# EasyEDA Pro project Buck-Boost_1.eprj

# Schematic Schematic1
Create Date: 2024-04-07; Page Name: P1; Project Name: Buck-Boost_1; Schematic Name: Schematic1; Update Date: 2024-04-13; Company: 嘉立创EDA; Page Size: A3; Version: V1.0
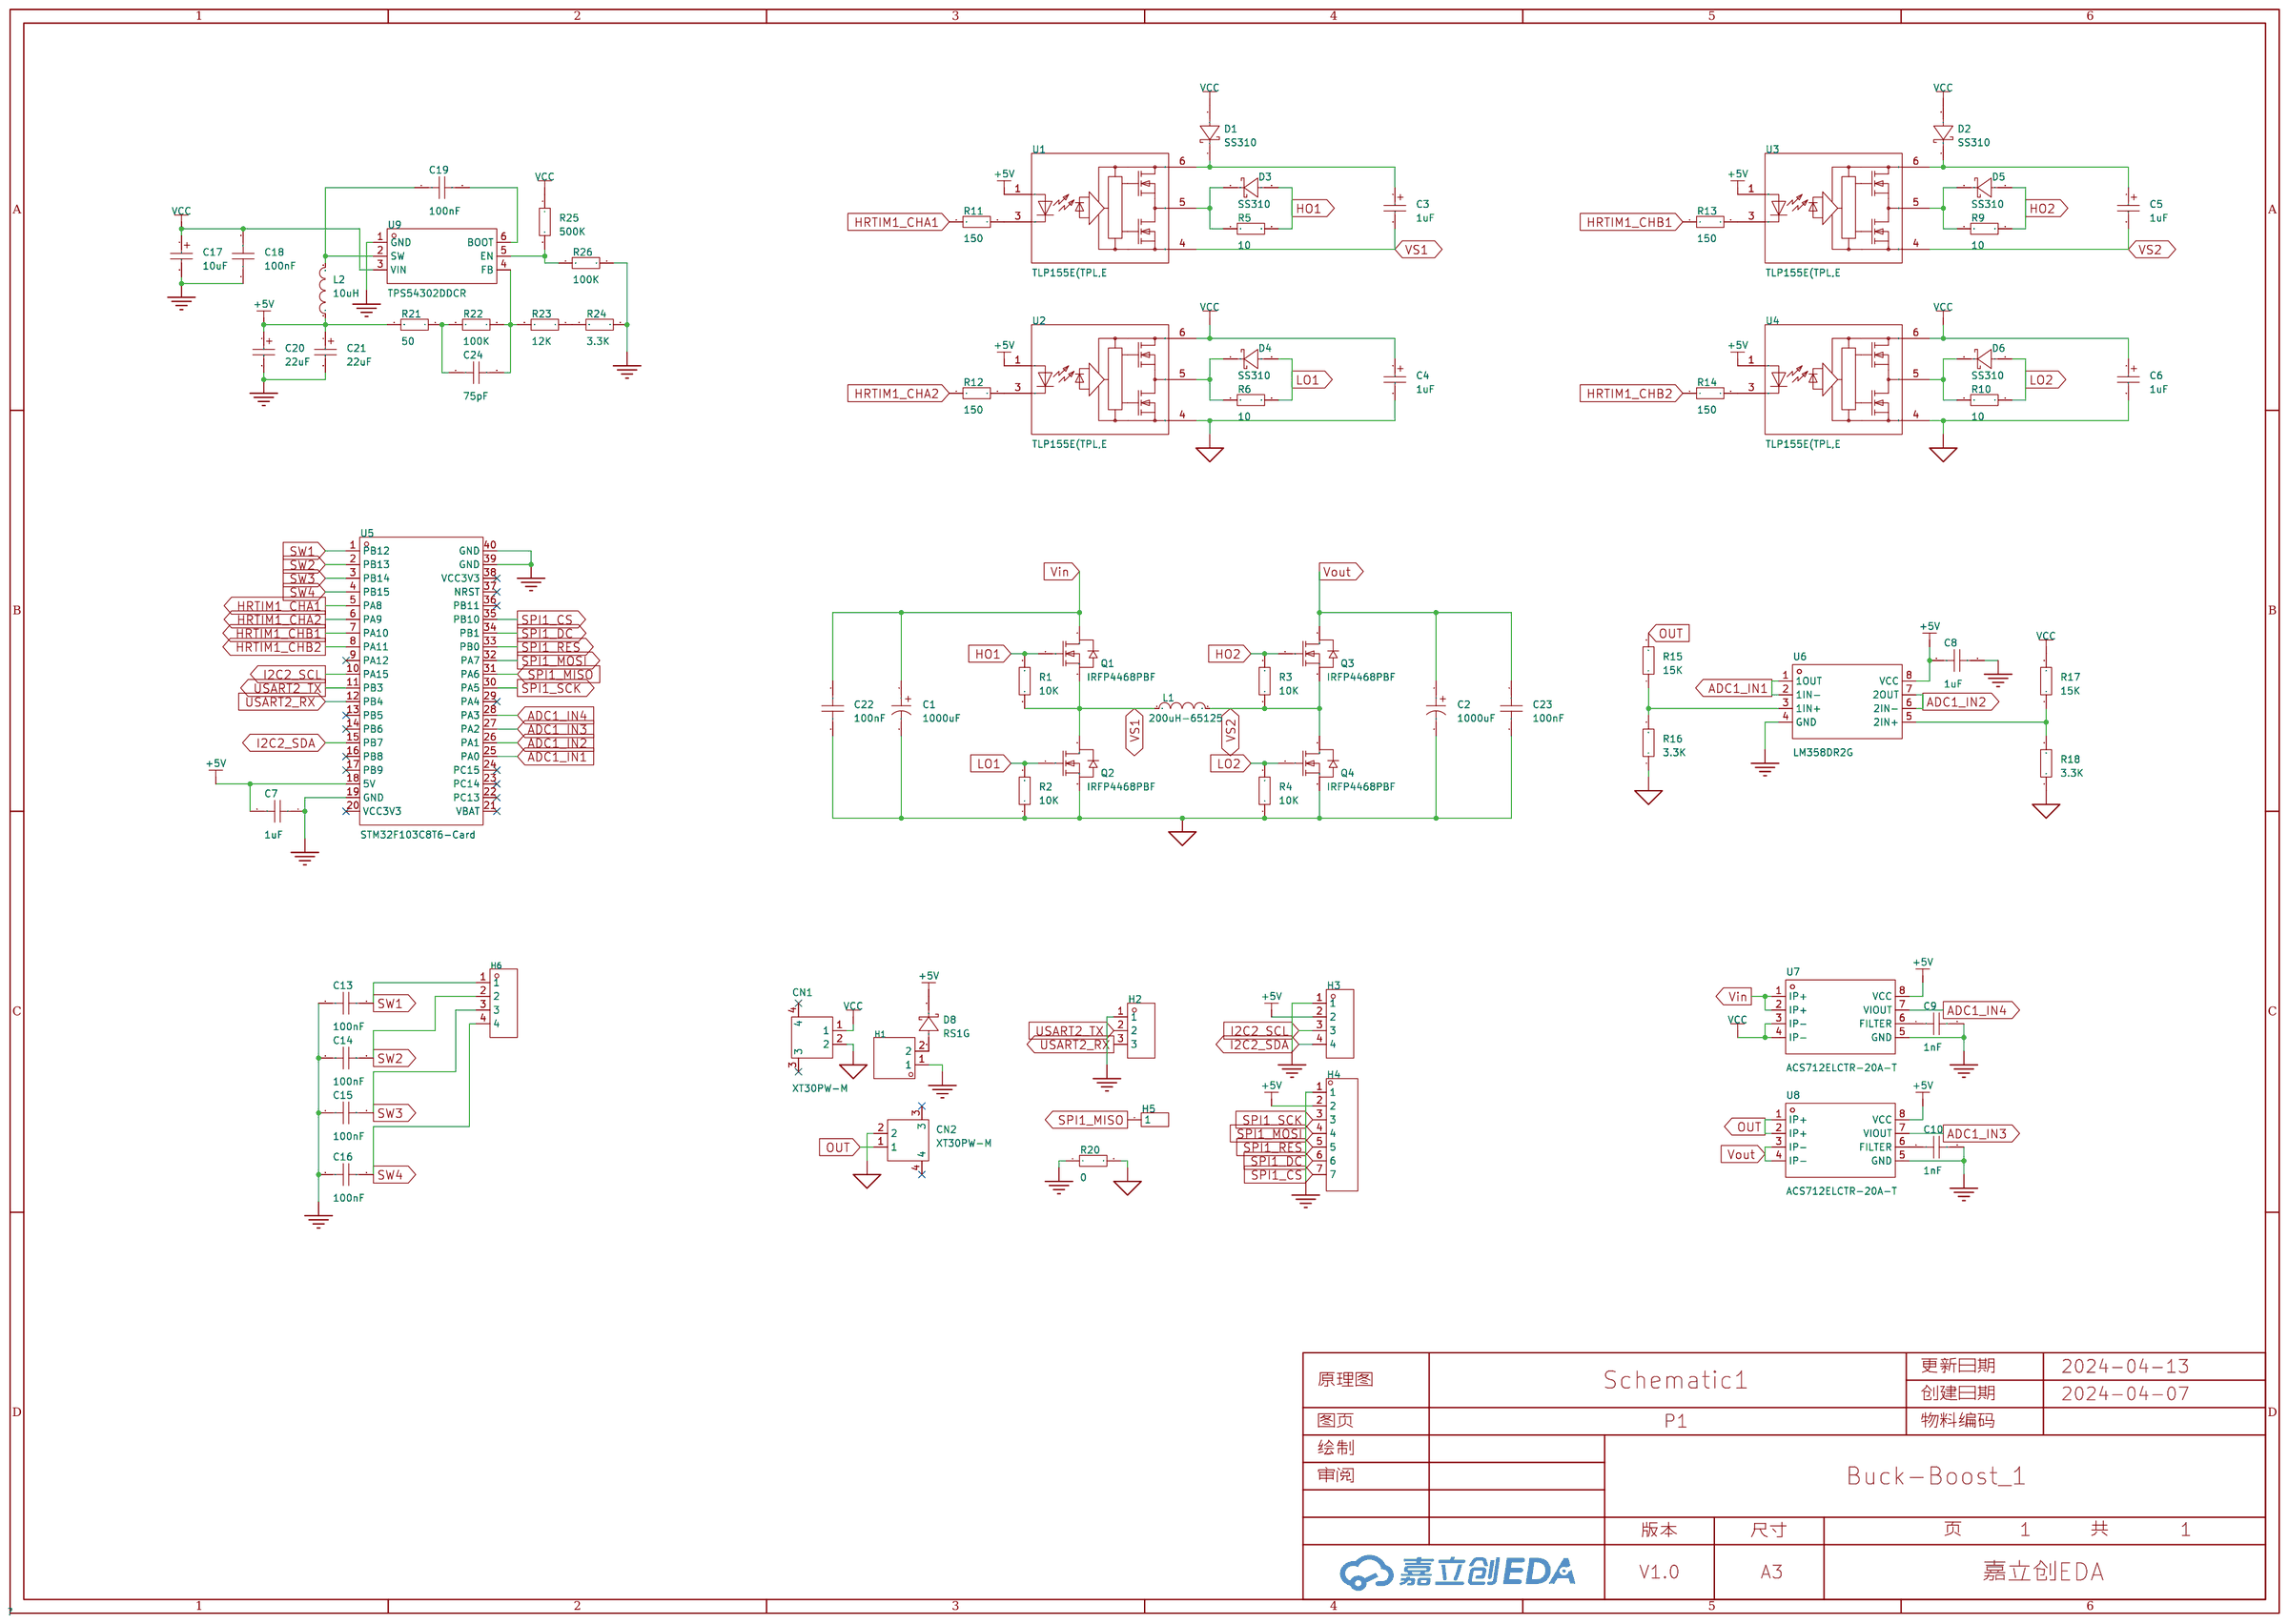
[diagram p0: schematic sheet]

## Parts
C1  1000uF  [CAP-TH_BD13.0-P5.00-D0.6-FD]
C2  1000uF  [CAP-TH_BD13.0-P5.00-D0.6-FD]
C3  1uF  [CASE-A_3216]
C4  1uF  [CASE-A_3216]
C5  1uF  [CASE-A_3216]
C6  1uF  [CASE-A_3216]
C7  1uF  [C0805]
C8  1uF  [C0805]
C9  1nF  [C0805]
C10  1nF  [C0805]
C13  100nF  [C0805]
C14  100nF  [C0805]
C15  100nF  [C0805]
C16  100nF  [C0805]
C17  10uF  [CAP-SMD_L3.5-W2.8-R-RD]
C18  100nF  [C0603]
C19  100nF  [C0603]
C20  22uF  [CASE-B_3528]
C21  22uF  [CASE-B_3528]
C22  100nF  [C0805]
C23  100nF  [C0805]
C24  75pF  [C0603]
CN1  XT30PW-M  [CONN-TH_XT30PW-M]
CN2  XT30PW-M  [CONN-TH_XT30PW-M]
D1  SS310  [SMA_L4.3-W2.6-LS5.2-RD]
D2  SS310  [SMA_L4.3-W2.6-LS5.2-RD]
D3  SS310  [SMA_L4.3-W2.6-LS5.2-RD]
D4  SS310  [SMA_L4.3-W2.6-LS5.2-RD]
D5  SS310  [SMA_L4.3-W2.6-LS5.2-RD]
D6  SS310  [SMA_L4.3-W2.6-LS5.2-RD]
D8  RS1G  [SMA_L4.3-W2.6-LS5.0-RD]
H1  -  [HDR-TH_2P-P2.54-V-M-1]
H2  -  [HDR-TH_3P-P2.54-V-M]
H3  -  [HDR-TH_4P-P2.54-V-F]
H4  -  [HDR-TH_7P-P2.54-V-F]
H5  -  [HDR-TH_1P-V-M_XKB_X4611WV-01I-C28D40]
H6  -  [HDR-TH_4P-P2.54-V-M]
L1  200uH-65125  [IND-TH_200UH-65125]
L2  10uH  [IND-SMD_L4.4-W4.2]
Q1  IRFP4468PBF  [TO-247AC-3_L15.8-W5.0-P5.46-L]
Q2  IRFP4468PBF  [TO-247AC-3_L15.8-W5.0-P5.46-L]
Q3  IRFP4468PBF  [TO-247AC-3_L15.8-W5.0-P5.46-L]
Q4  IRFP4468PBF  [TO-247AC-3_L15.8-W5.0-P5.46-L]
R1  10K  [R0805]
R2  10K  [R0805]
R3  10K  [R0805]
R4  10K  [R0805]
R5  10  [R0805]
R6  10  [R0805]
R9  10  [R0805]
R10  10  [R0805]
R11  150  [R0805]
R12  150  [R0805]
R13  150  [R0805]
R14  150  [R0805]
R15  15K  [R0805]
R16  3.3K  [R0805]
R17  15K  [R0805]
R18  3.3K  [R0805]
R20  0  [R0805]
R21  50  [R0603]
R22  100K  [R0603]
R23  12K  [R0603]
R24  3.3K  [R0603]
R25  500K  [R0603]
R26  100K  [R0603]
U1  TLP155E(TPL,E  [OPTO-SMD-5_L3.7-W4.6-P1.27-LS7.0-BR]
U2  TLP155E(TPL,E  [OPTO-SMD-5_L3.7-W4.6-P1.27-LS7.0-BR]
U3  TLP155E(TPL,E  [OPTO-SMD-5_L3.7-W4.6-P1.27-LS7.0-BR]
U4  TLP155E(TPL,E  [OPTO-SMD-5_L3.7-W4.6-P1.27-LS7.0-BR]
U5  STM32F103C8T6-Card  [CONN-TH_L53.3-W22.9_STM32F103C8T6-CARD]
U6  LM358DR2G  [SOIC-8_L5.0-W4.0-P1.27-LS6.0-BL]
U7  ACS712ELCTR-20A-T  [SOIC-8_L4.9-W3.9-P1.27-LS6.0-BL]
U8  ACS712ELCTR-20A-T  [SOIC-8_L4.9-W3.9-P1.27-LS6.0-BL]
U9  TPS54302DDCR  [SOT-23-6_L2.9-W1.6-P0.95-LS2.8-BL]

## Library data of the parts
C1 C2 = KF102M050I250A: 容值:1000uF;精度:±20%;额定电压:50V;; LCSC Part Name: 1000uF ±20% 50V; Supplier Part: C59328; Manufacturer: CapXon(丰宾); Supplier Footprint: 插件,D13xL25mm; JLCPCB Part Class: Extended Part; Datasheet: https://atta.szlcsc.com/upload/public/pdf/source/20160702/1467448308274.pdf; Supplier: LCSC; Tolerance: ±20%; Rated Voltage: 50V; Lead Spacing: 5mm; φD: 13mm; L: 25mm; Lifetime @ Temp: 5000hrs@105℃
C3-C6 = TAJA105K035RNJ: 容值:1uF;精度:±10%;额定电压:35V;等效串联电阻:7.5Ω@100kHz;; LCSC Part Name: 1uF ±10% 35V; Supplier Part: C7176; Manufacturer: Kyocera AVX; Supplier Footprint: CASE-A-3216; JLCPCB Part Class: Extended Part; Datasheet: https://atta.szlcsc.com/upload/public/pdf/source/20160107/1457707750344.pdf; Supplier: LCSC; Tolerance: ±10%; Rated Voltage: 35V; Equivalent Series Resistance(ESR): 7.5Ω@100kHz; Operating Temperature: -55℃~+125℃
C7-C10 C13-C16 C24 = CAP_0603: Supplier Footprint: 0603
C17 = TAJB106K025RNJ: 容值:10uF;精度:±10%;额定电压:25V;等效串联电阻:2.5Ω@100kHz;; LCSC Part Name: 10uF ±10% 25V; Supplier Part: C7194; Manufacturer: Kyocera AVX; Supplier Footprint: CASE-B-3528; JLCPCB Part Class: 扩展库; Datasheet: https://atta.szlcsc.com/upload/public/pdf/source/20160107/1457707750344.pdf; Supplier: LCSC; Tolerance: ±10%; Rated Voltage: 25V; Equivalent Series Resistance(ESR): 2.5Ω@100kHz; Operating Temperature: -55℃~+125℃
C18 C19 C22 C23 = CAP_0805: Supplier Footprint: 0805
C20 C21 = TAJB226K016RNJ: 容值:22uF;精度:±10%;额定电压:16V;等效串联电阻:2.3Ω@100kHz;; LCSC Part Name: 22uF ±10% 16V; Supplier Part: C8020; Manufacturer: Kyocera AVX; Supplier Footprint: CASE-B-3528; JLCPCB Part Class: Extended Part; Datasheet: https://atta.szlcsc.com/upload/public/pdf/source/20160107/1457707750344.pdf; Supplier: LCSC; Tolerance: ±10%; Rated Voltage: 16V; Equivalent Series Resistance(ESR): 2.3Ω@100kHz; Operating Temperature: -55℃~+125℃
CN1 CN2 = XT30PW-M: 类别:-;类型1:-;; LCSC Part Name: AMASS(艾迈斯)航模插头 卧式弯脚 XT30PW-M公头; Supplier Part: C431092; Manufacturer: AMASS(艾迈斯); JLCPCB Part Class: 扩展库; Datasheet: https://atta.szlcsc.com/upload/public/pdf/source/20220222/6A9F22F7850E25B33E1BE430ADF8560B.pdf; Supplier: LCSC; Brand: 艾迈斯; Type: 航模插头; RatedVoltage: DC 500V; InterfaceType: 公头; RatedCurrent: 15A; RecommendedWireGauge: 16/18/20AWG; contact resistance: 1.2mΩ; specifications: 2pin
D1-D6 = SS310_C15874: 正向压降(Vf):850mV@3A;直流反向耐压(Vr):100V;平均整流电流(Io):3A;; LCSC Part Name: 电压:100V 电流:3A; Supplier Part: C15874; Manufacturer: MDD; Supplier Footprint: SMA(DO-214AC); JLCPCB Part Class: Extended Part; Datasheet: https://atta.szlcsc.com/upload/public/pdf/source/20230314/A80AE34493C69B89E2F4B1712F433538.pdf; Supplier: LCSC; Forward Voltage (Vf@If): 850mV@3A; Reverse Voltage (Vr): 100V; Average Rectified Current (Io): 3A; Reverse Leakage Current (Ir): 500uA@100V; Reverse Leakage Current: 5uA; Reverse Recovery Time (trr): 150ns; Operating Temperature: -55℃~+150℃; Diode Configuration: 独立式
D8 = RS1G_C18199117: 二极管配置:独立式;正向压降(Vf):1.3V@1.0A;直流反向耐压(Vr):400V;平均整流电流(Io):1A;反向恢复时间(trr):150ns;; LCSC Part Name: 电压:400V 电流:1A; Supplier Part: C18199117; Manufacturer: 宏迦橙; Supplier Footprint: SMA(DO-214AC); JLCPCB Part Class: Extended Part; Datasheet: https://atta.szlcsc.com/upload/public/pdf/source/20230925/2DA11C666C5D1E1EAD04936CEF3A63C9.pdf; Supplier: LCSC; Diode Configuration: 独立式; Forward Voltage (Vf@If): 1.3V@1.0A; Reverse Voltage (Vr): 400V; Average Rectified Current (Io): 1A; Reverse Leakage Current: 5uA@400V; Reverse Recovery Time (trr): 150ns; Operating Temperature: -55℃~+150℃; Reverse Leakage Current (Ir): 500uA@100V
H1 = HDR-M_2.54_1x2P: Supplier Part: C124375; Supplier Footprint: 插件
H2 = HDR-M_2.54_1x3P: Supplier Part: C2937625; Supplier Footprint: 插件
H3 = HDR-F_2.54_1x4P: Supplier Part: C2718488; Supplier Footprint: 插件
H4 = HDR-F_2.54_1x7P: Supplier Part: C124418; Supplier Footprint: 插件
H5 = HDR-M_2.54_1x1P: Supplier Part: C81276; Supplier Footprint: 插件; JLCPCB Part Class: Extended Part
H6 = HDR-M_2.54_1x4P: Supplier Part: C492403; Supplier Footprint: 插件
L1 = 200uH-65125: Supplier Part: C9900012734; Supplier Footprint: IND-TH; JLCPCB Part Class: Extended Part; Supplier: LCSC
L2 = FXL0420-100-M: 电感值:10uH;精度:±20%;额定电流:1.6A;饱和电流(Isat):2.2A;类型:一体成型电感;; LCSC Part Name: 10uH ±20% 2.2A; Supplier Part: C177242; Manufacturer: cjiang(长江微电); Supplier Footprint: SMD,4.2x4.4mm; JLCPCB Part Class: Extended Part; Datasheet: https://atta.szlcsc.com/upload/public/pdf/source/20200117/C485363_A2440626DC7482D75DD0DD56D1883FBF.pdf; Supplier: LCSC; Tolerance: ±20%; Rated Current: 1.6A; Saturation Current (Isat): 2.2A; DC Resistance (DCR): 282mΩ; Type: 一体成型电感
Q1-Q4 = IRFP4468PBF: 类型:N沟道;漏源电压(Vdss):100V;连续漏极电流(Id):195A;功率(Pd):520W;导通电阻(RDS(on)@Vgs,Id):2.6mΩ@10V,180A;阈值电压(Vgs(th)@Id):4V@250uA;; LCSC Part Name: N沟道 耐压:100V 电流:195A; Supplier Part: C2919; Manufacturer: Infineon(英飞凌); Supplier Footprint: TO-247AC-3; JLCPCB Part Class: 扩展库; Datasheet: https://atta.szlcsc.com/upload/public/pdf/source/20200421/C513172_0206954A6A294F6A4994DAF9F319B5AC.pdf; Supplier: LCSC; Type: N沟道; Drain Source Voltage (Vdss): 100V; Continuous Drain Current (Id): 195A; Power Dissipation (Pd): 520W; Drain Source On Resistance (RDS(on)@Vgs,Id): 2.6mΩ@10V,180A; Gate Threshold Voltage (Vgs(th)@Id): 4V@250uA; Total Gate Charge (Qg@Vgs): 540nC@10V; Input Capacitance (Ciss@Vds): 19.86nF@50V; Operating Temperature: -55℃~+175℃@(Tj)
R1-R6 R9-R18 R20 = Res_0603: Supplier Footprint: 0603
R21-R26 = Res_0805: Supplier Footprint: 0805
U1-U4 = TLP155E(TPL,E: 输入类型:DC;电源电压:10V~30V;共模瞬变抗扰度CMTI:15kV/us;传播延迟tpLH/tpHL:170ns；170ns;; Supplier Part: C56499; Manufacturer: TOSHIBA(东芝); Supplier Footprint: SOIC-5-4.6mm; JLCPCB Part Class: 扩展库; Datasheet: https://atta.szlcsc.com/upload/public/pdf/source/20150821/1457707350132.pdf; Supplier: LCSC; Input Type: DC; Supply Voltage: 10V~30V; Common Mode Transient Immunity (CMTI): 15kV/us; Propagation Delay tpLH/tpHL: 170ns；170ns; Number of Channels: 1; Operating Temperature: -40℃~+100℃
U5 = STM32F103C8T6-Card: Supplier Part: C9900077949; Supplier Footprint: 插件; Supplier: LCSC
U6 = LM358DR2G: 放大器数:双路;增益带宽积(GBP):1MHz;输入偏置电流(Ib):45nA;压摆率(SR):-;带宽(-3db):-;; LCSC Part Name: LM358DR2G 运算放大器，单电源，双路; Supplier Part: C7950; Manufacturer: onsemi(安森美); Supplier Footprint: SOIC-8; JLCPCB Part Class: 基础库; Datasheet: https://atta.szlcsc.com/upload/public/pdf/source/20150124/1457707258826.pdf; Supplier: LCSC; Number of Circuits: 双路; Gain Bandwidth Product(GBP): 1MHz; Current - Input Bias(Ib): 45nA; Output Current: 40mA; Supply Current: 1.5mA; Operating Temperature: 0℃~+70℃
U7 U8 = ACS712ELCTR-20A-T: 电流测量范围:20A;灵敏度:100mV/A;; Supplier Part: C10681; Manufacturer: ALLEGRO(美国埃戈罗); Supplier Footprint: SOIC-8; JLCPCB Part Class: 扩展库; Datasheet: https://atta.szlcsc.com/upload/public/pdf/source/20130706/1457706622210.pdf; Supplier: LCSC; Current Range: 20A; Supply Voltage: 5V; Sensitivity: 100mV/A; Operating Temperature: -40℃~+85℃
U9 = TPS54302DDCR: 功能类型:降压型;输出类型:可调;输入电压:4.5V~28V;输出电压:596mV~28V;输出电流(最大值):3A;; Supplier Part: C311983; Manufacturer: TI(德州仪器); Supplier Footprint: TSOT-23-6; JLCPCB Part Class: 扩展库; Datasheet: https://www.ti.com/cn/lit/gpn/tps54302; Supplier: LCSC; Function: 降压型; Output Type: 可调; Input Voltage: 4.5V~28V; Output Voltage: 596mV~28V; Output Current (Max): 3A; Switching Frequency: 400kHz; Operating Temperature: -40℃~+125℃@(TJ); Synchronous Rectification: 是; Number of Outputs: 1; Topology: 降压式; Switch tube (built-in/external): 内置

## Nets
+5V: C7.2 C8.1 C20.1 C21.1 D8.1(K) H3.2 H4.2 L2.1 R21.2 U1.1(AN) U2.1(AN) U3.1(AN) U4.1(AN) U5.18(5V) U6.8(VCC) U7.8(VCC) U8.8(VCC)
AGND: C1.2 C2.2 C4.2 C6.2 C22.2 C23.2 CN1.2 CN2.2 Q2.3(S) Q4.3(S) R2.1 R4.1 R16.1 R18.1 R20.2 U2.4(GND) U4.4(GND)
GND: C7.1 C8.2 C9.2 C10.2 C13.1 C14.1 C15.1 C16.1 C17.2 C18.1 C20.2 C21.2 H1.1 H2.1 H3.1 H4.1 R20.1 R24.2 R26.2 U5.19(GND) U5.39(GND) U5.40(GND) U6.4(GND) U7.5(GND) U8.5(GND) U9.1(GND)
VCC: C4.1 C6.1 C17.1 C18.2 CN1.1 D1.2(A) D2.2(A) R17.2 R25.1 U2.6(VCC) U4.6(VCC) U7.3(IP-) U7.4(IP-) U9.3(VIN)
Vin: C1.1 C22.1 Q1.2(D) U7.1(IP+) U7.2(IP+)
ADC1_IN1: U5.25(PA0) U6.1(1OUT) U6.2(1IN-)
ADC1_IN2: U5.26(PA1) U6.6(2IN-) U6.7(2OUT)
ADC1_IN3: U5.27(PA2) U8.7(VIOUT)
ADC1_IN4: U5.28(PA3) U7.7(VIOUT)
HO1: D3.2(A) Q1.1(G) R1.2 R5.2
HO2: D5.2(A) Q3.1(G) R3.2 R9.2
HRTIM1_CHA1: R11.1 U5.5(PA8)
HRTIM1_CHA2: R12.1 U5.6(PA9)
HRTIM1_CHB1: R13.1 U5.7(PA10)
HRTIM1_CHB2: R14.1 U5.8(PA11)
I2C2_SCL: H3.3 U5.10(PA15)
I2C2_SDA: H3.4 U5.15(PB7)
LO1: D4.2(A) Q2.1(G) R2.2 R6.2
LO2: D6.2(A) Q4.1(G) R4.2 R10.2
OUT: CN2.1 R15.2 U8.1(IP+) U8.2(IP+)
SPI1_CS: H4.7 U5.35(PB10)
SPI1_DC: H4.6 U5.34(PB1)
SPI1_MISO: H5.1 U5.31(PA6)
SPI1_MOSI: H4.4 U5.32(PA7)
SPI1_RES: H4.5 U5.33(PB0)
SPI1_SCK: H4.3 U5.30(PA5)
SW1: C13.2 H6.1 U5.1(PB12)
SW2: C14.2 H6.2 U5.2(PB13)
SW3: C15.2 H6.3 U5.3(PB14)
SW4: C16.2 H6.4 U5.4(PB15)
USART2_RX: H2.3 U5.12(PB4)
USART2_TX: H2.2 U5.11(PB3)
Vout: C2.1 C23.1 Q3.2(D) U8.3(IP-) U8.4(IP-)
VS1: C3.2 L1.1 Q1.3(S) Q2.2(D) R1.1 U1.4(GND)
VS2: C5.2 L1.2 Q3.3(S) Q4.2(D) R3.1 U3.4(GND)
$1N1235: D4.1(K) R6.1 U2.5(VO)
$1N1253: D3.1(K) R5.1 U1.5(VO)
$1N1489: C3.1 D1.1(K) U1.6(VCC)
$1N2345: R15.1 R16.2 U6.3(1IN+)
$1N3865: R11.2 U1.3(CAT)
$1N3891: R12.2 U2.3(CAT)
$1N4391: C9.1 U7.6(FILTER)
$1N4589: R17.1 R18.2 U6.5(2IN+)
$1N15576: D6.1(K) R10.1 U4.5(VO)
$1N15577: D5.1(K) R9.1 U3.5(VO)
$1N15585: R13.2 U3.3(CAT)
$1N15586: R14.2 U4.3(CAT)
$1N15724: C10.1 U8.6(FILTER)
$1N19181: D8.2(A) H1.2
$1N21866: C5.1 D2.1(K) U3.6(VCC)
$1N29389: R23.1 R24.1
$1N29611: C19.2 U9.6(BOOT)
$1N29695: R25.2 R26.1 U9.5(EN)
$1N29983: C19.1 L2.2 U9.2(SW)
$1N32235: C24.1 R21.1 R22.2
$1N32239: C24.2 R22.1 R23.2 U9.4(FB)

Not connected (* = marked no-connect by the designer): CN1 3* 4*; CN2 3* 4*; U5 9(PA12)* 13(PB5)* 14(PB6)* 16(PB8)* 17(PB9)* 20(VCC3V3)* 21(VBAT)* 22(PC13)* 23(PC14)* 24(PC15)* 29(PA4)* 36(PB11)* 37(NRST)* 38(VCC3V3)*

# Board PCB1
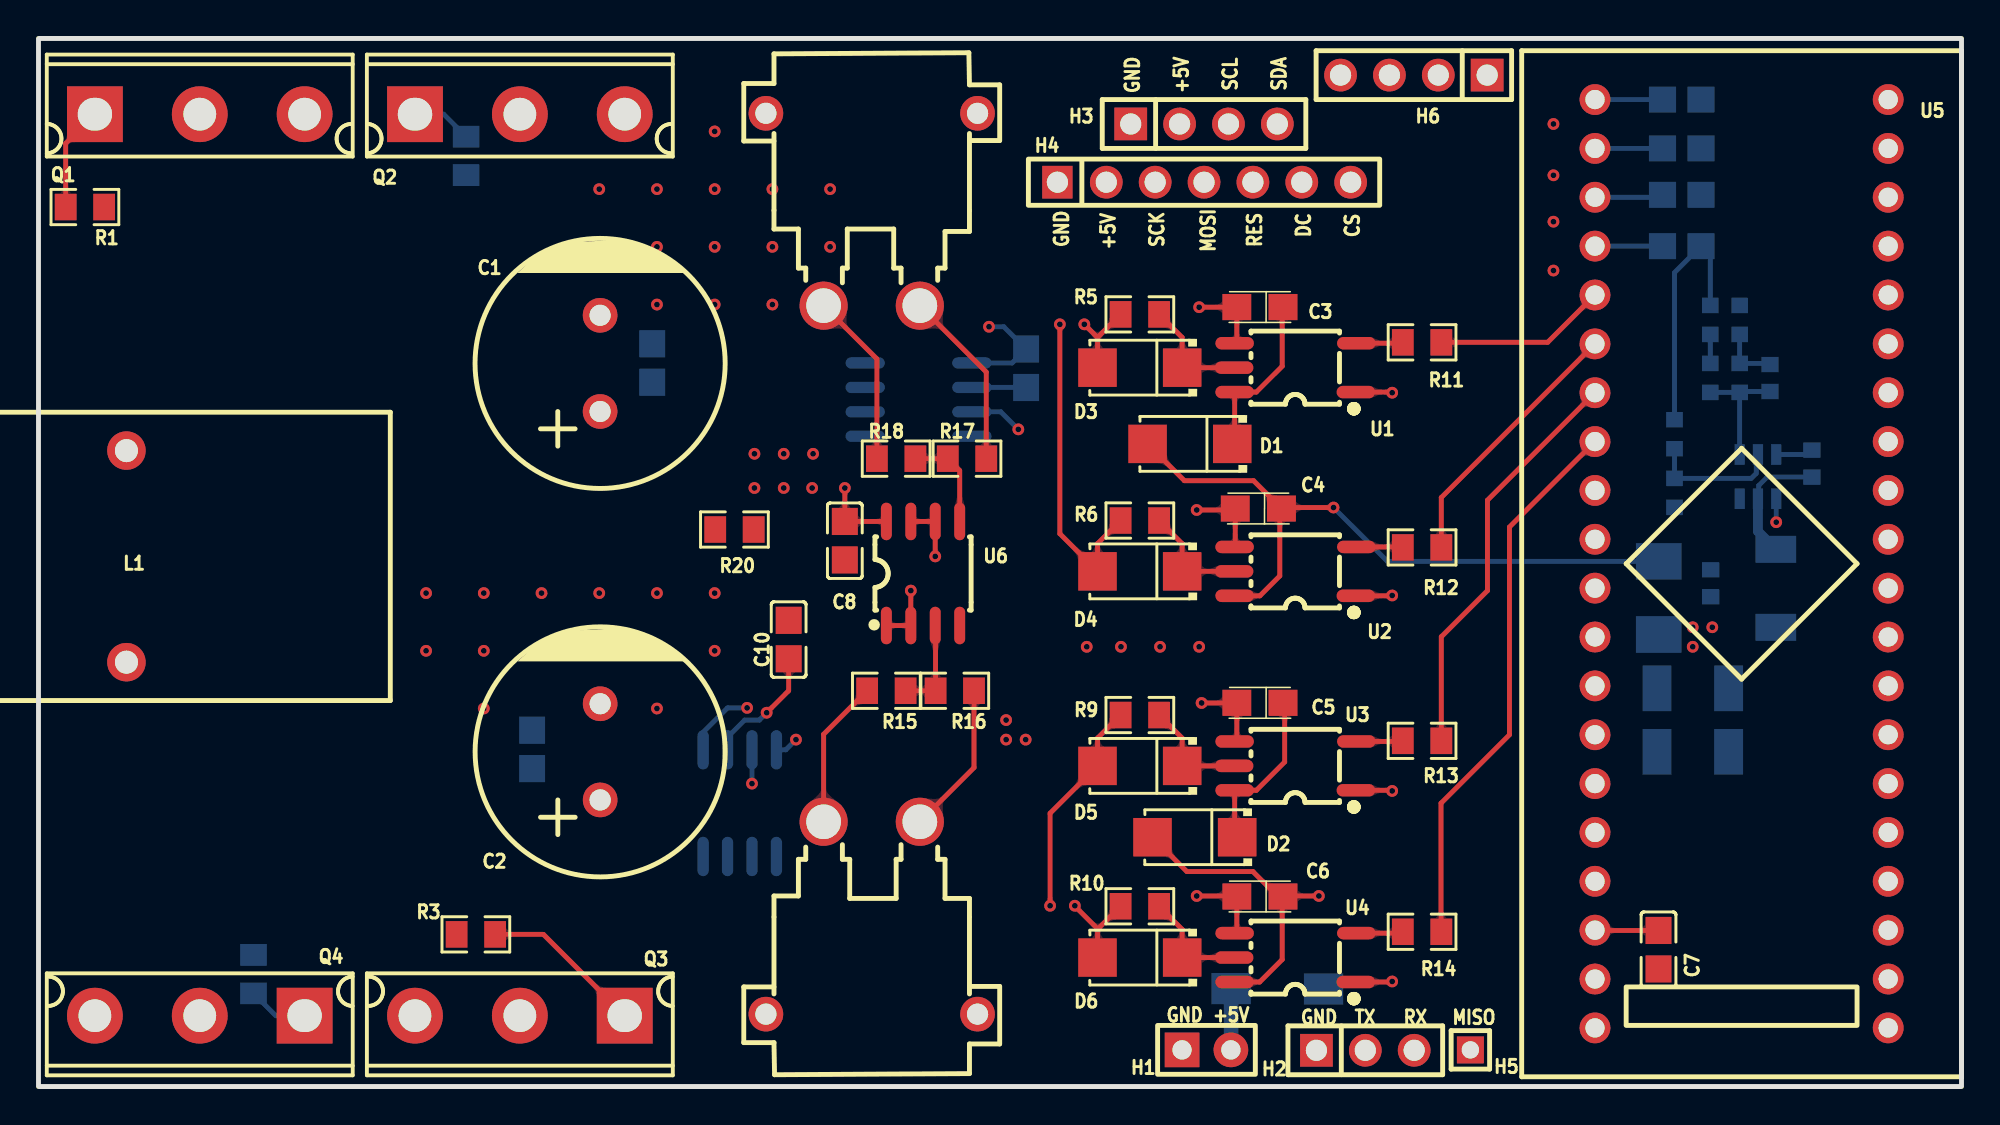
[diagram p1: board, top side]
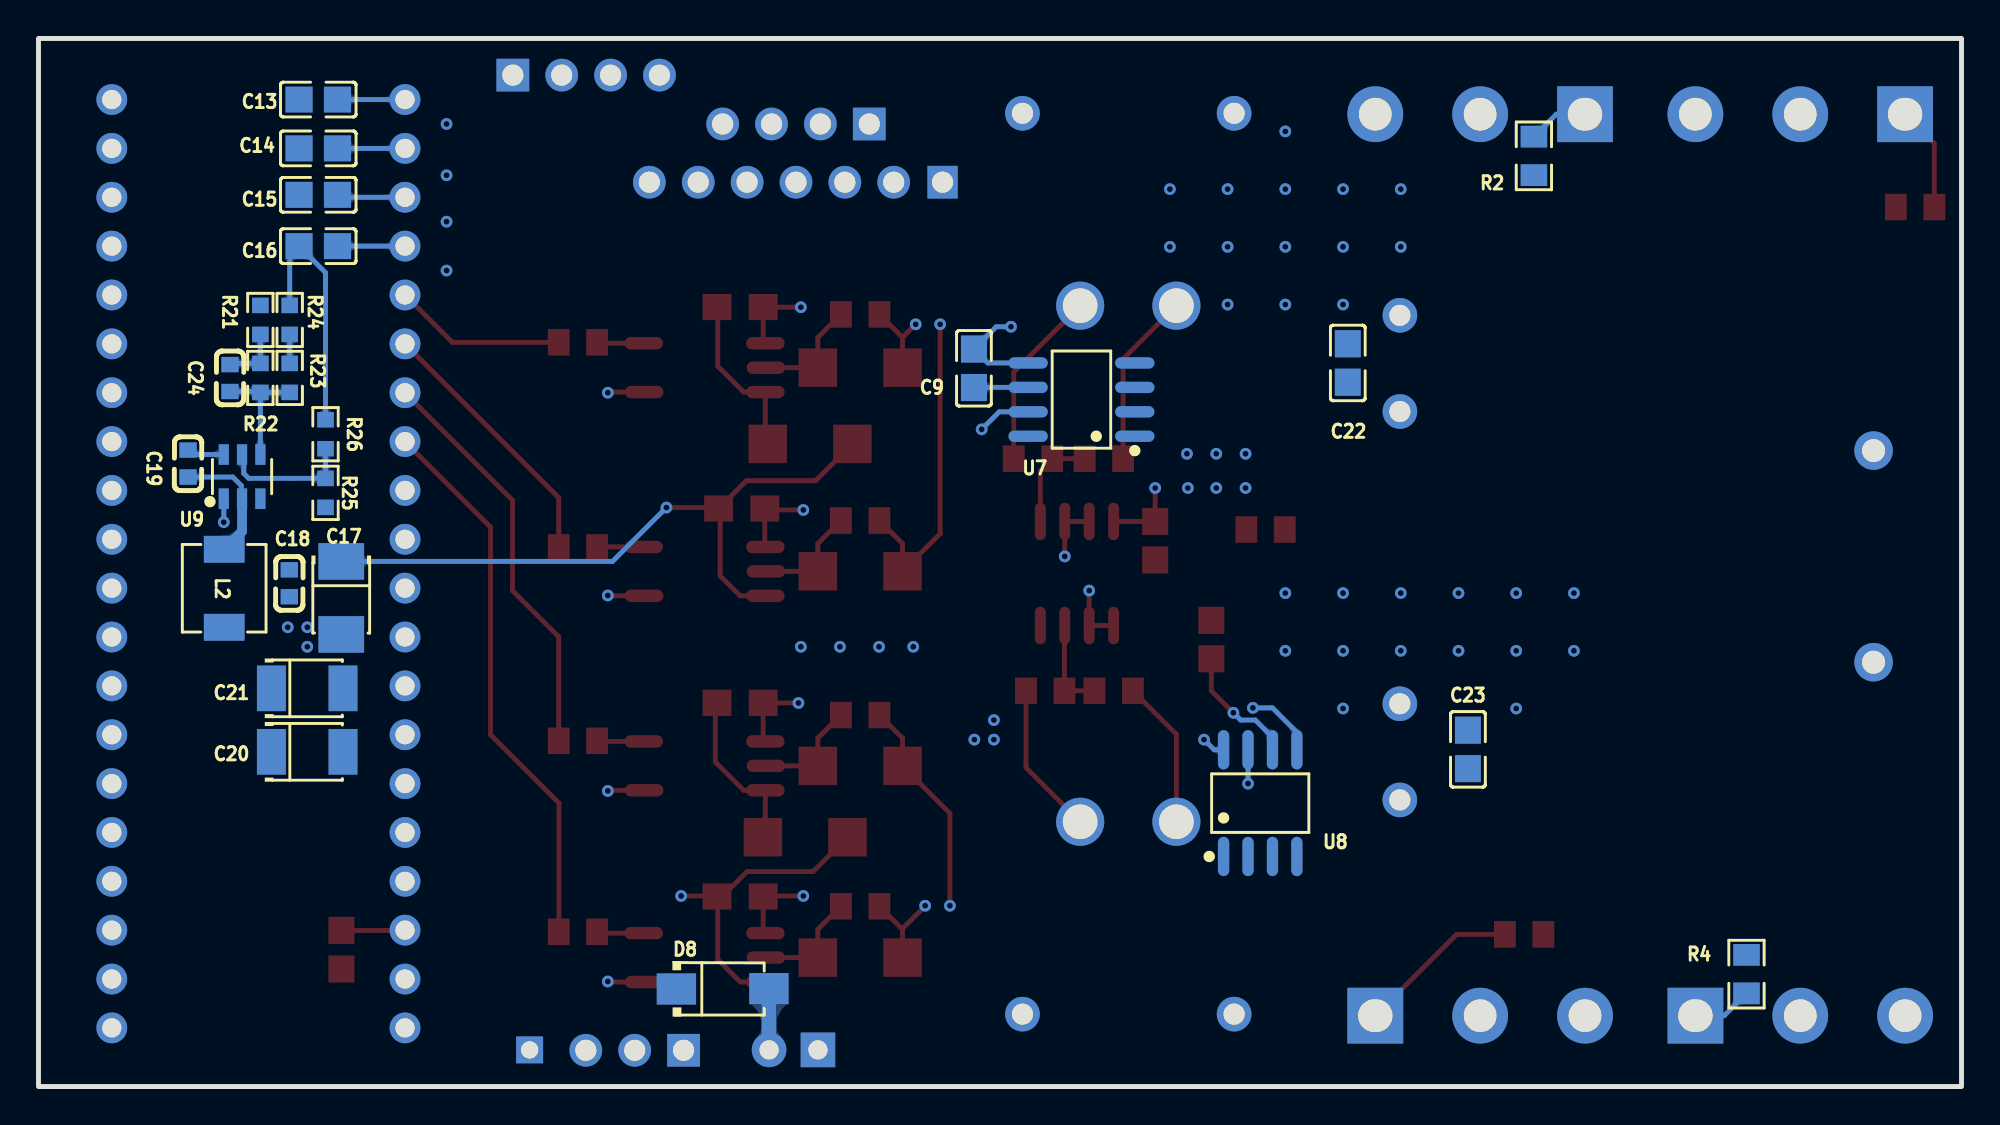
[diagram p2: board, bottom side, seen from below]

Outline 99.95 x 54.48 mm; copper layers: Top Layer, Inner1, Inner2, Bottom Layer. Coordinates in mm from the lower left corner of the outline.
Outline path: rectangle 0,54.48 99.95,0
Stack: Top Layer 0.035mm 外层铜厚1oz / Dielectric1 0.2104mm 7628 RC49% 8.6mil / Inner1 0.0152mm 内层铜厚 / Dielectric2 1.065mm 1.1mm H/HOZ 含铜 / Inner2 0.0152mm 内层铜厚 / Dielectric3 0.2104mm 7628 RC49% 8.6mil / Bottom Layer 0.035mm 外层铜厚1oz

## Design rules (mm)
template: 自定义配置
spacing copperThickness1oz (default): track to track 0.102, other pairs 0.152 to 0.3
spacing copperThickness2oz: track to track 0.203, other pairs 0.152 to 0.3
track width copperThickness1oz (default): min 0.127, default 0.254, max 2.54
track width copperThickness2oz: min 0.203, default 0.254, max 2.54
differential pair differentialPair (default): width min 0.127, default 0.254, max 2.54; gap min 0.152, default 0.152
via viaSize (default): diameter min 0.5, default 0.61, max 10; hole min 0.3, default 0.305, max 6.3

## Placement (name value [footprint] x y rotation side)
C1  1000uF  [CAP-TH_BD13.0-P5.00-D0.6-FD]  29.19 37.59 90 top
C2  1000uF  [CAP-TH_BD13.0-P5.00-D0.6-FD]  29.19 17.4 90 top
C3  1uF  [CASE-A_3216]  63.48 40.52 180 top
C4  1uF  [CASE-A_3216]  63.4 30.05 180 top
C5  1uF  [CASE-A_3216]  63.48 19.95 180 top
C6  1uF  [CASE-A_3216]  63.48 9.88 180 top
C7  1uF  [C0805]  84.2 7.11 90 top
C8  1uF  [C0805]  41.91 28.38 270 top
C9  1nF  [C0805]  51.33 37.34 90 bottom
C10  1nF  [C0805]  38.99 23.24 90 top
C13  100nF  [C0805]  85.41 51.31 180 bottom
C14  100nF  [C0805]  85.41 48.77 180 bottom
C15  100nF  [C0805]  85.41 46.36 180 bottom
C16  100nF  [C0805]  85.41 43.69 180 bottom
C17  10uF  [CAP-SMD_L3.5-W2.8-R-RD]  84.21 25.4 90 bottom
C18  100nF  [C0603]  86.91 26.16 90 bottom
C19  100nF  [C0603]  92.17 32.39 90 bottom
C20  22uF  [CASE-B_3528]  85.98 17.4 180 bottom
C21  22uF  [CASE-B_3528]  85.98 20.7 180 bottom
C22  100nF  [C0805]  31.9 37.61 90 bottom
C23  100nF  [C0805]  25.65 17.53 90 bottom
C24  75pF  [C0603]  90 36.83 270 bottom
CN1  XT30PW-M  [CONN-TH_XT30PW-M]  43.31 45.59 180 top
CN2  XT30PW-M  [CONN-TH_XT30PW-M]  43.31 8.76 0 top
D1  SS310  [SMA_L4.3-W2.6-LS5.2-RD]  59.85 33.41 180 top
D2  SS310  [SMA_L4.3-W2.6-LS5.2-RD]  60.1 12.96 180 top
D3  SS310  [SMA_L4.3-W2.6-LS5.2-RD]  57.24 37.37 180 top
D4  SS310  [SMA_L4.3-W2.6-LS5.2-RD]  57.24 26.78 180 top
D5  SS310  [SMA_L4.3-W2.6-LS5.2-RD]  57.24 16.67 180 top
D6  SS310  [SMA_L4.3-W2.6-LS5.2-RD]  57.24 6.7 180 top
D8  RS1G  [SMA_L4.3-W2.6-LS5.0-RD]  64.39 5.08 180 bottom
H1  -  [HDR-TH_2P-P2.54-V-M-1]  60.71 1.91 0 top
H2  -  [HDR-TH_3P-P2.54-V-M]  68.96 1.88 0 top
H3  -  [HDR-TH_4P-P2.54-V-F]  60.58 50.04 0 top
H4  -  [HDR-TH_7P-P2.54-V-F]  60.58 47.01 0 top
H5  -  [HDR-TH_1P-V-M_XKB_X4611WV-01I-C28D40]  74.42 1.91 0 top
H6  -  [HDR-TH_4P-P2.54-V-M]  71.48 52.58 180 top
L1  200uH-65125  [IND-TH_200UH-65125]  4.57 27.56 180 top
L2  10uH  [IND-SMD_L4.4-W4.2]  90.3 25.9 270 bottom
Q1  IRFP4468PBF  [TO-247AC-3_L15.8-W5.0-P5.46-L]  8.38 50.55 0 top
Q2  IRFP4468PBF  [TO-247AC-3_L15.8-W5.0-P5.46-L]  25.02 50.55 0 top
Q3  IRFP4468PBF  [TO-247AC-3_L15.8-W5.0-P5.46-L]  25.02 3.68 180 top
Q4  IRFP4468PBF  [TO-247AC-3_L15.8-W5.0-P5.46-L]  8.38 3.68 180 top
R1  10K  [R0805]  2.41 45.72 180 top
R2  10K  [R0805]  22.22 48.38 90 bottom
R3  10K  [R0805]  22.73 7.91 0 top
R4  10K  [R0805]  11.18 5.84 270 bottom
R5  10  [R0805]  57.24 40.14 180 top
R6  10  [R0805]  57.24 29.42 180 top
R9  10  [R0805]  57.24 19.31 180 top
R10  10  [R0805]  57.24 9.37 180 top
R11  150  [R0805]  71.91 38.69 180 top
R12  150  [R0805]  71.91 28.03 180 top
R13  150  [R0805]  71.91 17.97 180 top
R14  150  [R0805]  71.91 8.05 180 top
R15  15K  [R0805]  44.07 20.57 180 top
R16  3.3K  [R0805]  47.62 20.57 180 top
R17  15K  [R0805]  48.26 32.64 0 top
R18  3.3K  [R0805]  44.58 32.64 0 top
R20  0  [R0805]  36.17 28.96 180 top
R21  50  [R0603]  88.42 39.85 90 bottom
R22  100K  [R0603]  88.42 36.84 90 bottom
R23  12K  [R0603]  86.89 36.84 270 bottom
R24  3.3K  [R0603]  86.89 39.85 90 bottom
R25  500K  [R0603]  85.03 30.86 90 bottom
R26  100K  [R0603]  85.03 33.91 90 bottom
U1  TLP155E(TPL,E  [OPTO-SMD-5_L3.7-W4.6-P1.27-LS7.0-BR]  65.32 37.37 0 top
U2  TLP155E(TPL,E  [OPTO-SMD-5_L3.7-W4.6-P1.27-LS7.0-BR]  65.32 26.78 0 top
U3  TLP155E(TPL,E  [OPTO-SMD-5_L3.7-W4.6-P1.27-LS7.0-BR]  65.32 16.67 0 top
U4  TLP155E(TPL,E  [OPTO-SMD-5_L3.7-W4.6-P1.27-LS7.0-BR]  65.32 6.7 0 top
U5  STM32F103C8T6-Card  [CONN-TH_L53.3-W22.9_STM32F103C8T6-CARD]  88.52 27.18 270 top
U6  LM358DR2G  [SOIC-8_L5.0-W4.0-P1.27-LS6.0-BL]  45.97 26.67 0 top
U7  ACS712ELCTR-20A-T  [SOIC-8_L4.9-W3.9-P1.27-LS6.0-BL]  45.74 35.71 90 bottom
U8  ACS712ELCTR-20A-T  [SOIC-8_L4.9-W3.9-P1.27-LS6.0-BL]  36.45 14.73 180 bottom
U9  TPS54302DDCR  [SOT-23-6_L2.9-W1.6-P0.95-LS2.8-BL]  89.37 31.71 180 bottom

## Footprints (pads in the part's own frame, mm; a bottom-side part is the same pattern mirrored in y, then rotated)
C0603
  rect 0.8x0.9 smd: 1(-0.7,0) 2(0.7,0)
C0805
  rect 1.41x1.35 smd: 1(-1,0) 2(1,0)
CAP-SMD_L3.5-W2.8-R-RD
  rect 1.9x2.376 smd: 1(1.899,0) 2(-1.899,0)
CAP-TH_BD13.0-P5.00-D0.6-FD
  round 1.8 hole 1.1: 1(-2.5,0) 2(2.5,0)
CASE-A_3216
  rect 1.5x1.359 smd: 1(-1.2,0) 2(1.2,0)
CASE-B_3528
  rect 1.506x2.376 smd: 1(-1.861,0) 2(1.861,0)
CONN-TH_L53.3-W22.9_STM32F103C8T6-CARD
  round 1.6 hole 1: 1(-24.13,-7.62) 2(-21.59,-7.62) 3(-19.05,-7.62) 4(-16.51,-7.62) 5(-13.97,-7.62) 6(-11.43,-7.62) 7(-8.89,-7.62) 8(-6.35,-7.62) 9(-3.81,-7.62) 10(-1.27,-7.62) 11(1.27,-7.62) 12(3.81,-7.62) 13(6.35,-7.62) 14(8.89,-7.62) 15(11.43,-7.62) 16(13.97,-7.62) 17(16.51,-7.62) 18(19.05,-7.62) 19(21.59,-7.62) 20(24.13,-7.62) 21(24.13,7.62) 22(21.59,7.62) 23(19.05,7.62) 24(16.51,7.62) 25(13.97,7.62) 26(11.43,7.62) 27(8.89,7.62) 28(6.35,7.62) 29(3.81,7.62) 30(1.27,7.62) 31(-1.27,7.62) 32(-3.81,7.62) 33(-6.35,7.62) 34(-8.89,7.62) 35(-11.43,7.62) 36(-13.97,7.62) 37(-16.51,7.62) 38(-19.05,7.62) 39(-21.59,7.62) 40(-24.13,7.62)
CONN-TH_XT30PW-M
  round 2.5 hole 1.8: 1(-2.5,5) 2(2.5,5)
  round 1.8 hole 1.1: 3(5.5,-5) 4(-5.5,-5)
HDR-TH_1P-V-M_XKB_X4611WV-01I-C28D40
  rect 1.4x1.4 hole 0.9: 1(0,0)
HDR-TH_2P-P2.54-V-M-1
  rect 1.8x1.8 hole 1: 1(-1.27,0)
  round 1.8 hole 1: 2(1.27,0)
HDR-TH_3P-P2.54-V-M
  rect 1.7x1.7 hole 1.1: 1(-2.54,0)
  round 1.7 hole 1.1: 2(0,0) 3(2.54,0)
HDR-TH_4P-P2.54-V-F
  rect 1.7x1.7 hole 1.1: 1(-3.81,0)
  round 1.7 hole 1.1: 2(-1.27,0) 3(1.27,0) 4(3.81,0)
HDR-TH_4P-P2.54-V-M
  rect 1.7x1.7 hole 1.1: 1(-3.81,0)
  round 1.7 hole 1.1: 2(-1.27,0) 3(1.27,0) 4(3.81,0)
HDR-TH_7P-P2.54-V-F
  rect 1.575x1.7 hole 1.1: 1(-7.62,0)
  round 1.7 hole 1.1: 2(-5.08,0) 3(-2.54,0) 4(0,0) 5(2.54,0) 6(5.08,0) 7(7.62,0)
IND-SMD_L4.4-W4.2
  rect 1.4x2.12 smd: 1(2.028,0) 2(-2.028,0)
IND-TH_200UH-65125
  round 2 hole 1.2: 1(0,-5.5) 2(0,5.5)
OPTO-SMD-5_L3.7-W4.6-P1.27-LS7.0-BR
  oval 2x0.65 smd: 1(3.15,-1.27) 3(3.175,1.27) 4(-3.15,1.27) 5(-3.175,0) 6(-3.15,-1.27)
R0603
  rect 0.806x0.864 smd: 1(-0.753,0) 2(0.753,0)
R0805
  rect 1.133x1.377 smd: 1(-1,0) 2(1,0)
SMA_L4.3-W2.6-LS5.0-RD
  rect 2.046x1.62 smd: 1(-2.404,-0.009) 2(2.404,0.009)
SMA_L4.3-W2.6-LS5.2-RD
  rect 2x2 smd: 1(-2.2,0) 2(2.2,0)
SOIC-8_L4.9-W3.9-P1.27-LS6.0-BL
  oval 0.588x2.045 smd: 1(-1.905,-2.772) 2(-0.635,-2.772) 3(0.635,-2.772) 4(1.905,-2.772) 5(1.905,2.772) 6(0.635,2.772) 7(-0.635,2.772) 8(-1.905,2.772)
SOIC-8_L5.0-W4.0-P1.27-LS6.0-BL
  oval 0.569x1.95 smd: 1(-1.905,-2.705) 2(-0.635,-2.705) 3(0.635,-2.705) 4(1.905,-2.705) 5(1.905,2.705) 6(0.635,2.705) 7(-0.635,2.705) 8(-1.905,2.705)
SOT-23-6_L2.9-W1.6-P0.95-LS2.8-BL
  rect 0.532x1.072 smd: 1(-0.95,-1.149) 2(0,-1.149) 3(0.95,-1.149) 4(0.95,1.149) 5(0,1.149) 6(-0.95,1.149)
TO-247AC-3_L15.8-W5.0-P5.46-L
  rect 2.9x2.9 hole 1.785x1.7: 1(-5.45,0)
  round 2.9 hole 1.7: 2(0,0) 3(5.45,0)

## Nets
As in the schematic, except:
VIN: C1.1 C22.1 Q1.2 U7.1 U7.2
VOUT: C2.1 C23.1 Q3.2 U8.3 U8.4

Pads without a net: CN1 3 4; CN2 3 4; U5 9 13 14 16 17 20 21 22 23 24 29 36 37 38

## Via types
v1: diameter 0.61, hole 0.305, Top Layer to Bottom Layer, 44 vias
v2: diameter 0.61, hole 0.304, Top Layer to Bottom Layer, 28 vias

## Routing (per net, layer and track width the routed paths; a pad name or vN(x,y) marks a point on that pad's centre or on a via; arc(x,y) is an arc through that point)
+5V: length 16
  Top Layer w0.254: U6.8 C8.1 v1(41.91,31.12) ; U1.1 70.33,36.1 v1(70.36,36.07) ; U3.1 70.33,15.4 v1(70.36,15.37) ; v1(70.36,25.53) 70.34,25.51 U2.1 ; C7.2 80.92,8.11 U5.18 ; U4.1 70.33,5.43 v1(70.36,5.46)
  Bottom Layer w0.254: v1(39.37,18.03) 38.84,17.5 U8.8
  vias: v1(50.29,19.05) v1(50.29,18.03) v1(51.31,18.03)
AGND: length 65
  Top Layer w0.254: U2.4 62.2,28.08 62.2,30.05 62.13,29.97 v1(60.2,29.97) ; R16.1 48.62,16.58 CN2.2 ; v1(60.2,9.91) 62.26,9.91 C6.2 62.28,8.09 U4.4 ; R18.1 43.58,37.82 CN1.2
  Inner1 w0.254: v1(60.2,9.91) 56.34,13.76 CN2.2 ; CN1.2 51.43,29.97 v1(60.2,29.97)
  vias: v2(20.14,25.65) v2(20.14,22.65) v2(23.14,25.65) v2(23.14,22.65) v2(23.14,19.65) v2(26.14,25.65) v2(26.14,22.65) v2(29.14,46.65) v2(29.14,43.65) v2(29.14,25.65) v2(29.14,22.65) v2(32.14,46.65) v2(32.14,43.65) v2(32.14,40.65) v2(32.14,25.65) v2(32.14,22.65) v2(32.14,19.65) v2(35.14,49.65) v2(35.14,46.65) v2(35.14,43.65) v2(35.14,40.65) v2(35.14,25.65) v2(35.14,22.65) v2(38.14,46.65) v2(38.14,43.65) v2(38.14,40.65) v2(41.14,46.65) v2(41.14,43.65)
GND: length 23.3
  Bottom Layer w0.254: v1(49.4,39.5) 50.17,39.5 C9.2 50.61,37.62 U7.5 ; v1(36.83,19.69) 35.81,19.69 34.54,18.42 U8.5 ; R24.2 86.89,43.2 C16.1 85.03,42.31 R26.2 ; U9.1 v1(90.32,29.34)
  vias: v1(37.21,32.89) v1(37.21,31.12) v1(38.73,32.89) v1(38.73,31.12) v1(40.26,32.89) v1(40.21,31.12) v1(54.48,22.86) v1(56.26,22.86) v1(58.29,22.86) v1(60.33,22.86) v1(78.74,50.04) v1(78.74,47.37) v1(78.74,44.96) v1(78.74,42.42) v1(85.98,23.88) v1(85.98,22.86) v1(86.99,23.88)
VCC: length 108
  Top Layer w0.254: C4.1 64.65,30.1 v1(67.31,30.1) ; C4.1 64.52,29.96 64.52,26.54 63.48,25.51 U2.6 ; C4.1 63.15,31.5 59.56,31.5 D1.2 ; R17.2 49.26,37.14 CN1.1 ; v1(66.55,9.91) 64.71,9.91 C6.1 ; U4.6 63.47,5.43 64.64,6.6 64.64,9.84 C6.1 ; D2.2 59.69,11.18 63.12,11.18 64.42,9.88 C6.1
  Inner1 w0.254: 66.55,30.06 66.58,30.1 v1(67.31,30.1) ; 66.55,30.06 v1(66.55,9.91) ; 66.55,30.06 66.55,31.75 64.77,33.53 52.87,33.53 CN1.1
  Bottom Layer w0.254: C17.1 70.11,27.3 v1(67.31,30.1)
ADC1_IN1: length 59.1
  Top Layer w0.254: v1(45.34,25.78) U6.2 U6.1
  Inner2 w0.254: U5.25 94.87,14.48 56.64,14.48 v1(45.34,25.78)
ADC1_IN2: length 57.5
  Top Layer w0.254: v1(46.61,27.56) U6.6 U6.7
  Inner2 w0.254: v1(46.61,27.56) 57.15,17.02 94.87,17.02 U5.26
ADC1_IN3: length 70.6
  Inner2 w0.254: U5.27 97.92,16.51 97.92,13.08 96.77,11.94 56.64,11.94 52.83,15.75 v1(37.08,15.75)
  Bottom Layer w0.254: U8.7 v1(37.08,15.75)
ADC1_IN4: length 54.6
  Inner2 w0.254: U5.28 94.87,19.56 65.53,19.56 v1(50.93,34.16)
  Bottom Layer w0.254: 48.51,35.08 50.02,35.08 v1(50.93,34.16)
HO1: length 66.3
  Top Layer w0.254: R5.2 55.04,38.94 ; R1.2 1.41,49.03 Q1.1 ; D3.2 55.04,38.94 v1(54.36,39.62)
  Inner1 w0.254: Q1.1 8.9,44.58 46.1,44.58 51.82,38.86 53.59,38.86 v1(54.36,39.62)
HO2: length 44.4
  Top Layer w0.254: Q3.1 26.24,7.91 R3.2 ; R9.2 55.04,18.11 D5.2 52.58,14.2 v1(52.58,9.4)
  Inner1 w0.254: Q3.1 36.18,9.4 v1(52.58,9.4)
HRTIM1_CHA1: length 9
  Top Layer w0.254: R11.1 78.44,38.69 U5.5
HRTIM1_CHA2: length 13.9
  Top Layer w0.254: U5.6 72.91,30.62 R12.1
HRTIM1_CHB1: length 21.4
  Top Layer w0.254: U5.7 75.31,30.48 75.31,25.78 72.91,23.38 R13.1
HRTIM1_CHB2: length 28.8
  Top Layer w0.254: R14.1 72.9,8.06 72.9,14.73 76.45,18.29 76.45,29.08 U5.8
I2C2_SCL: length 32.5
  Inner1 w0.254: H3.3 61.85,42.42 75.82,28.45 U5.10
I2C2_SDA: length 44.4
  Inner1 w0.254: H3.4 64.39,44.45 79.12,29.72 81.92,29.72 82.8,28.83 82.8,17.53 81.03,15.75 U5.15
LO1: length 58
  Top Layer w0.254: R6.2 55.04,28.22 D4.2 53.09,28.74 v1(53.09,39.62)
  Inner1 w0.254: v1(53.09,39.62) 47.24,45.47 24.65,45.47 Q2.1
  Bottom Layer w0.254: R2.2 21.06,50.55 Q2.1
LO2: length 51.7
  Top Layer w0.254: R10.2 55.04,8.17 ; 55.04,8.17 55.04,8.2 53.85,9.4 ; 55.04,8.17 D6.2
  Inner1 w0.254: v1(53.86,9.4) 52.34,10.92 21.07,10.92 Q4.1
  Bottom Layer w0.254: R4.2 12.33,3.68 Q4.1
OUT: length 7.7
  Top Layer w0.254: R15.2 40.81,18.31 CN2.1
SPI1_CS: length 31.4
  Inner2 w0.254: U5.35 94.87,39.88 75.33,39.88 H4.7
SPI1_DC: length 35
  Inner2 w0.254: U5.34 94.87,37.34 75.33,37.34 H4.6
SPI1_MISO: length 40.3
  Inner1 w0.254: U5.31 89.28,21.59 89.28,8.64 84.96,4.32 76.83,4.32 H5.1
SPI1_MOSI: length 42.2
  Inner2 w0.254: H4.4 75.33,32.26 94.87,32.26 U5.32
SPI1_RES: length 38.6
  Inner2 w0.254: U5.33 94.87,34.8 75.33,34.8 H4.5
SPI1_SCK: length 46.8
  Inner2 w0.254: U5.30 94.87,27.18 77.87,27.18 H4.3
SW1: length 9.6
  Inner2 w0.254: U5.1 76.56,51.31 H6.1
  Bottom Layer w0.254: U5.1 C13.2
SW2: length 13.2
  Inner2 w0.254: H6.2 76.56,48.77 U5.2
  Bottom Layer w0.254: U5.2 C14.2
SW3: length 16.9
  Inner2 w0.254: H6.3 76.56,46.23 U5.3
  Bottom Layer w0.254: C15.2 84.28,46.23 U5.3
SW4: length 20.4
  Inner2 w0.254: U5.4 76.56,43.69 H6.4
  Bottom Layer w0.254: U5.4 C16.2
USART2_RX: length 31.2
  Inner1 w0.254: U5.12 73.66,23.37 69.6,19.3 69.6,3.79 H2.3
USART2_TX: length 32.2
  Inner1 w0.254: U5.11 75.31,25.91 68.96,19.56 H2.2
VS1: length 43.4
  Top Layer w0.254: v1(60.33,40.51) 62.28,40.51 C3.2 62.28,38.75 U1.4
  Inner1 w0.254: v1(60.33,40.51) 53.59,40.51 45.97,48.13 27.43,48.13 25.02,50.55
VS2: length 62.7
  Top Layer w0.254: v1(60.45,19.94) 62.28,19.94 C5.2 62.28,18.05 U3.4
  Inner1 w0.254: v1(60.45,19.94) 57.4,16.89 21.59,16.89 Q4.2
$1N1235: length 5.8
  Top Layer w0.254: U2.5 D4.1 59.44,28.22 R6.1
$1N1253: length 6
  Top Layer w0.254: U1.5 D3.1 59.44,38.94 R5.1
$1N1489: length 8.9
  Top Layer w0.254: D1.1 62.17,33.53 U1.6 63.3,36.1 64.64,37.45 64.64,40.48 C3.1
$1N2345: length 5
  Top Layer w0.254: U6.3 46.62,23.95 R16.2 R15.1
$1N3865: length 2.4
  Top Layer w0.254: R11.2 70.86,38.64 U1.3
$1N3891: length 2.4
  Top Layer w0.254: R12.2 70.89,28.05 U2.3
$1N4391: length 2.8
  Bottom Layer w0.254: C9.1 51.32,36.35 U7.6
$1N4589: length 5.2
  Top Layer w0.254: R18.2 R17.1 47.88,32.02 U6.5
$1N15576: length 5.9
  Top Layer w0.254: U4.5 D6.1 59.44,8.17 R10.1
$1N15577: length 5.8
  Top Layer w0.254: U3.5 D5.1 59.44,18.11 R9.1
$1N15585: length 2.4
  Top Layer w0.254: U3.3 70.88,17.94 R13.2
$1N15586: length 2.4
  Top Layer w0.254: R14.2 70.84,7.97 U4.3
$1N15724: length 6.5
  Top Layer w0.254: v1(37.85,19.43) 38.99,20.57 C10.1
  Bottom Layer w0.254: v1(37.85,19.43) 37.46,19.05 36.7,19.05 35.81,18.16 U8.6
$1N19181: length 3.2
  Bottom Layer w0.762: H1.2 61.98,1.91 D8.2
$1N21866: length 8.8
  Top Layer w0.254: 62.3,12.96 62.17,13.09 U3.6 63.3,15.4 64.77,16.87 64.77,19.86 C5.1
$1N29389: length 1.5
  Bottom Layer w0.254: R23.1 R24.1
$1N29611: length 2
  Bottom Layer w0.254: U9.6 91.94,32.86 92.17,33.09
$1N29695: length 6.7
  Bottom Layer w0.254: U9.5 89.28,32.77 89.28,31.88 89.02,31.61 85.28,31.61 ; R25.2 R26.1
$1N29983: length 6.7
  Bottom Layer w0.254: U9.2 89.41,30.6 89.41,31.24 89.85,31.69 C19.1
  Bottom Layer w0.508: U9.2 89.37,28.86 L2.2
$1N32235: length 3.1
  Bottom Layer w0.254: C24.1 89.93,37.59 R22.2 R21.1
$1N32239: length 6.3
  Bottom Layer w0.254: R22.1 88.46,36.13 C24.2 ; R22.1 88.42,32.86 ; R22.1 R23.2

## Copper pours and planes (outline as drawn; the poured copper is in the pictures)
+5V on Bottom Layer: 46.1,53.83 100.08,53.83 100.08,0.73 46.1,0.73
+5V on Inner1: 36.2,53.85 100.21,53.85 100.21,0.51 36.2,0.51
AGND on Top Layer: 43.23,48.33 43.23,39.38 36.05,33.64 36.05,13.02 37.12,11.94 41.97,11.94 43.31,13.28 43.31,15.62 44.45,16.76 47.12,16.76 48.26,15.62 48.26,5.19 43.45,0.38 34.24,0.38 25.8,9.02 22.22,9.02 17.14,14.1 17.14,31.88 27.69,42.42 27.69,52.07 29.21,53.59 37.97,53.59
AGND on Bottom Layer: 43.31,7.3 43.31,15.61 42.55,15.61 40.01,18.34 38.1,20.26 35.23,20.26 20.86,5.88 7.53,5.88 5.71,4.06 5.71,1.74 4.56,0.58 0.69,0.58 -0.64,1.91 -0.64,17.78 1.4,19.81 15.85,19.81 17.27,21.24 17.27,25.38 18.88,26.92 45.48,26.92 48.39,24.28 48.39,10.01 45.73,7.35 43.36,7.35
AGND on Bottom Layer: 43.37,35.75 43.43,35.69 30.52,35.69 17.87,48.35 26.5,48.35 27.94,49.78 27.94,51.31 30.35,53.72 37.9,53.72 43.37,48.25
GND on Top Layer: 35.94,53.85 100.08,53.85 100.08,0.51 35.94,0.51
GND on Bottom Layer: 87.63,25.87 87.63,23.82 85.98,22.18 85.98,16.54 85.36,15.92 82.63,15.92 82.04,16.51 82.04,24.64 83.27,25.87
GND on Bottom Layer: 85.53,52.34 97.27,52.34 97.92,51.69 97.92,48.01 97.41,47.5 94.11,47.5 89.28,42.67 85.47,42.67 85.34,42.55 85.34,52.15
GND on Inner2: 36.32,53.72 100.13,53.72 100.13,0.51 36.32,0.51
VCC on Bottom Layer: 88.75,30.86 88.75,29.06 87.88,28.19 87.88,26.44 87.59,26.15 82.8,26.15 82.68,26.04 82.68,30.1 83.44,30.86
VCC on Bottom Layer: 47.75,42.35 47.75,39.56 45.74,37.55 45.74,35.74 40.77,35.74 40.77,37.21 43.31,39.75 43.31,42.6 43.97,43.26 46.84,43.26
VIN on Bottom Layer: 45.72,35.78 40.77,35.78 40.77,37.21 36.07,37.21 35.69,37.59 29.08,37.59 18.33,48.35 12.23,48.35 10.92,49.65 10.92,52.83 10.16,53.59 6.98,53.59 5.71,52.32 5.71,40.01 8.25,37.47 14.86,37.47 17.27,35.05 17.27,28.83 18.92,27.18 45.47,27.18 45.72,27.44
OUT on Bottom Layer: 36.53,14.48 37.49,14.48 38.51,15.58 42.93,15.58 43.43,15.07 43.43,7.23 42.29,6.09 42.29,5.97 36.53,5.97
VOUT on Bottom Layer: 36.32,14.56 36.32,5.97 29.03,5.97 27.52,4.47 27.52,1.87 26.42,0.76 23.24,0.76 22.22,1.78 22.22,16.64 22.99,17.4 32.63,17.4 35.44,14.56
VS1 on Top Layer: 27.81,52.63 27.81,42.16 16.64,30.99 3.43,30.99 2.93,31.48 2.93,47.12 4.15,48.35 9.86,48.35 11.3,49.78 11.3,51.94 12.83,53.47 14.99,53.47 17.55,50.9 17.55,48.35 21.03,48.35 22.44,49.76 22.44,52.55 23.29,53.59 26.98,53.59
VS2 on Top Layer: 3.43,24 16.89,24 22.22,18.67 22.22,1.77 21.16,0.7 17.72,0.7 16.33,2.09 16.33,5 15.45,5.88 12.36,5.88 11.18,4.7 11.18,1.93 9.95,0.7 7.04,0.7 5.71,2.03 5.71,4.45 2.92,7.24 2.92,23.5

Small or netless copper shapes (teardrops, artwork), in the pictures only: 128 on Top Layer, 57 on Bottom Layer, 30 on Inner1, 26 on Inner2

## Text on the board
Top Silkscreen Layer: GND | +5V | TX | RX | SCK | MOSI | SCL | RES | SDA | DC | CS | MISO
